# EAGLE design sim800c_gsm_dev_board (EAGLE 7.6.0)
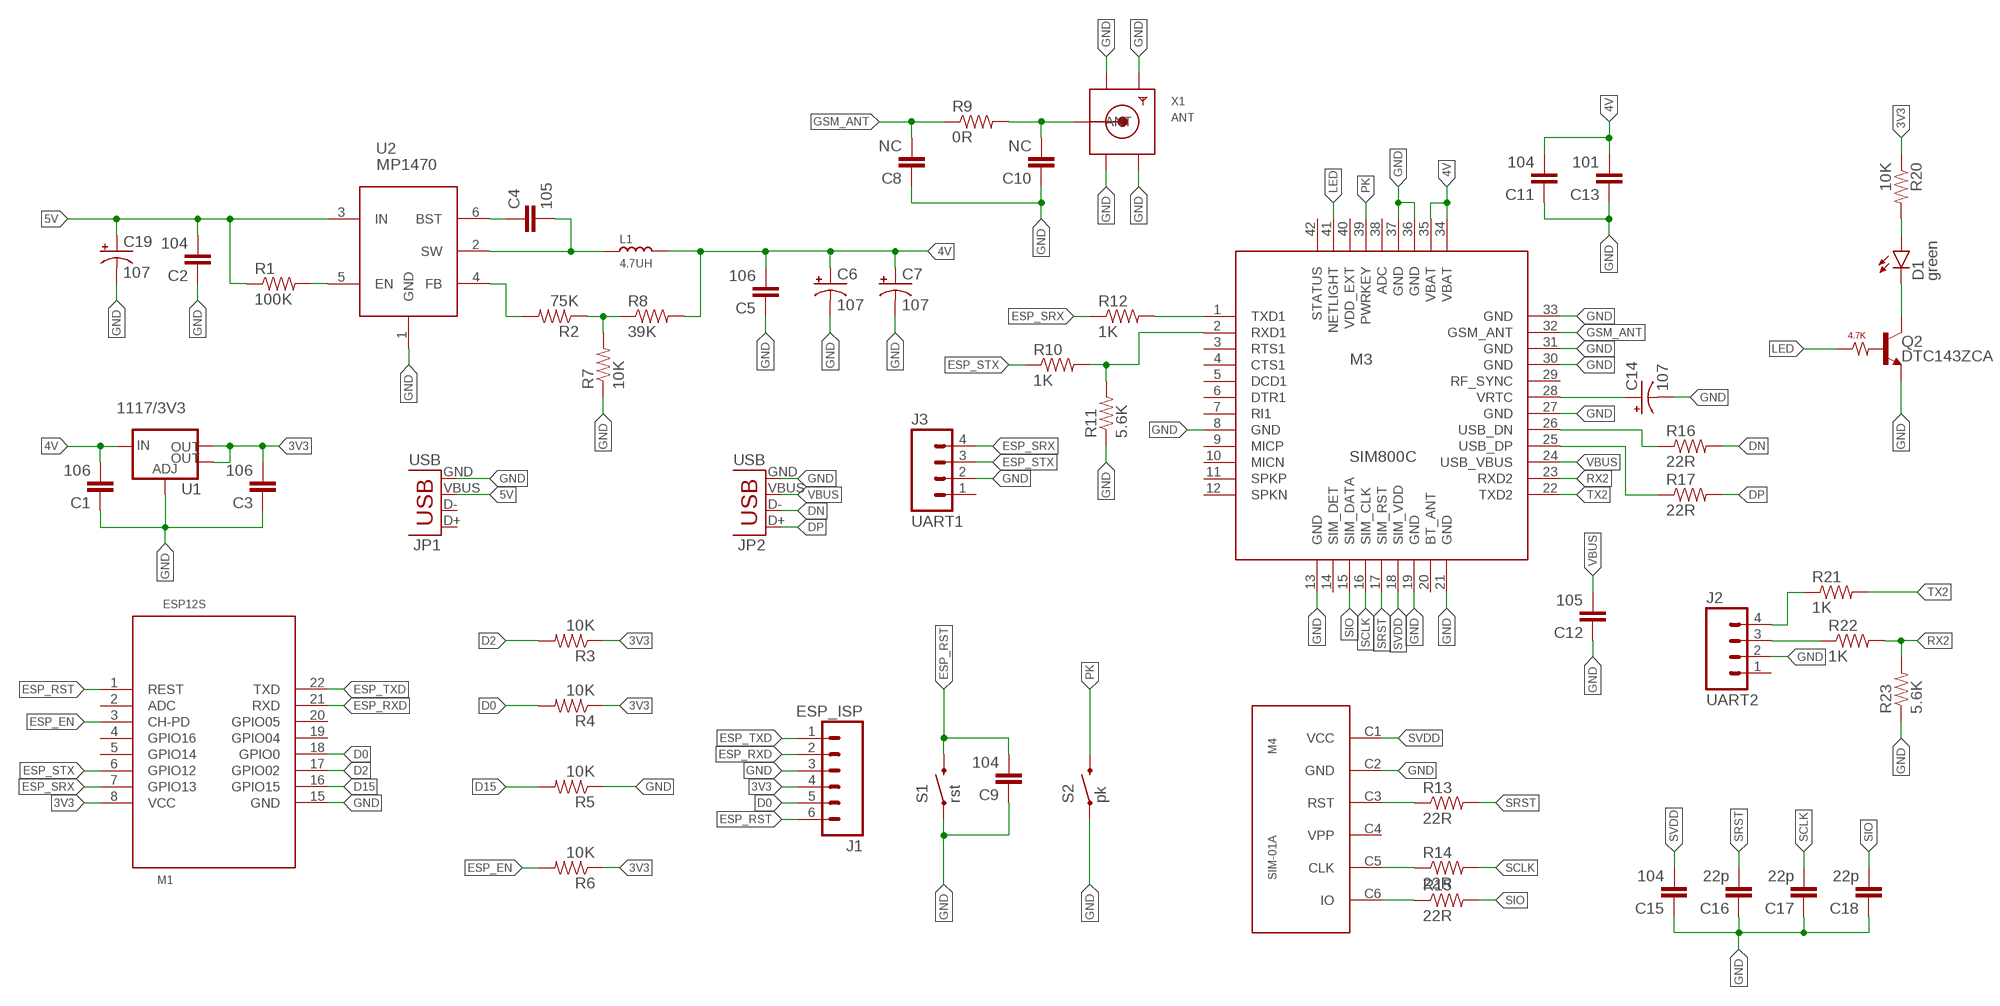
[diagram p0: schematic, sheet 1]

## Parts
C1  106  CAP0603-CAP  [0603-CAP]
C2  104  CAP0603-CAP  [0603-CAP]
C3  106  CAP0603-CAP  [0603-CAP]
C4  105  CAP0603-CAP  [0603-CAP]
C5  106  CAP0603-CAP  [0603-CAP]
C6  107  CAP_POL3528  [EIA3528]
C7  107  CAP_POL3528  [EIA3528]
C8  NC  CAP-SEEED-0402  [C0402]
C9  104  CAP-SEEED-0402  [C0402]
C10  NC  CAP-SEEED-0402  [C0402]
C11  104  CAP-SEEED-0402  [C0402]
C12  105  CAP0603-CAP  [0603-CAP]
C13  101  CAP-SEEED-0402  [C0402]
C14  107  CAP_POL3528  [EIA3528]
C15  104  CAP-SEEED-0402  [C0402]
C16  22p  CAP-SEEED-0402  [C0402]
C17  22p  CAP-SEEED-0402  [C0402]
C18  22p  CAP-SEEED-0402  [C0402]
C19  107  CAP_POL3528  [EIA3528]
D1  green  LED-SEEED-0603  [LED-0603-SEEED]
J1  ESP_ISP  M06NO_SILK_FEMALE_PTH  [1X06_NO_SILK]
J2  UART2  M04NO_SILK_ALL_ROUND  [1X04_NO_SILK_ALL_ROUND]
J3  UART1  M04NO_SILK_ALL_ROUND  [1X04_NO_SILK_ALL_ROUND]
JP1  USB  [MICROUSB-U-F-M5DD-Y-1]
JP2  USB  [MICROUSB-U-F-M5DD-Y-1]
L1  4.7UH  SMD-INDUCTOR-200UH-20%(2P-5X5MM)  [SMD-2P-5.0X5.0X2.0MM]
M1  ESP12S  MODULE-WIFI-ESP8266-12E-SIMPLE  [LGA22-2.0-24X16MM-SIMPLE]
M3  SIM800C  [SIM800C]
M4  SIM-01A  [SIM-01A]
Q2  DTC143ZCA  TRANS_NPN_RES-DDTD142TC-7-F  [SOT23-3]
R1  100K  RESISTOR-SEEED-0402  [R0402]
R2  75K  RESISTOR-SEEED-0402  [R0402]
R3  10K  RESISTOR-SEEED-0402  [R0402]
R4  10K  RESISTOR-SEEED-0402  [R0402]
R5  10K  RESISTOR-SEEED-0402  [R0402]
R6  10K  RESISTOR-SEEED-0402  [R0402]
R7  10K  RESISTOR-SEEED-0402  [R0402]
R8  39K  RESISTOR-SEEED-0402  [R0402]
R9  0R  RESISTOR-SEEED-0402  [R0402]
R10  1K  RESISTOR-SEEED-0402  [R0402]
R11  5.6K  RESISTOR-SEEED-0402  [R0402]
R12  1K  RESISTOR-SEEED-0402  [R0402]
R13  22R  RESISTOR-SEEED-0402  [R0402]
R14  22R  RESISTOR-SEEED-0402  [R0402]
R15  22R  RESISTOR-SEEED-0402  [R0402]
R16  22R  RESISTOR-SEEED-0402  [R0402]
R17  22R  RESISTOR-SEEED-0402  [R0402]
R20  10K  RESISTOR-SEEED-0402  [R0402]
R21  1K  RESISTOR-SEEED-0402  [R0402]
R22  1K  RESISTOR-SEEED-0402  [R0402]
R23  5.6K  RESISTOR-SEEED-0402  [R0402]
S1  rst  SWITCH-MOMENTARY-2SMD-4  [TACTILE_SWITCH_TALL]
S2  pk  SWITCH-MOMENTARY-2SMD-4  [TACTILE_SWITCH_TALL]
U1  1117/3V3  AMS1117SOT223  [SOT223]
U2  MP1470  [SOT23-6]
X1  ANT  SMACONNECTOR  [SMA90_DIP]

## Nets
3V3: C3.2 J1.4 M1.8(VCC) R3.1 R4.1 R6.1 R20.1 U1.2(OUT) U1.4(OUT)
4V: C1.2 C5.2 C6.A(+) C7.A(+) C11.2 C13.2 L1.2 M3.34(VBAT) M3.35(VBAT) R8.2 U1.3(IN)
5V: C2.2 C19.A(+) JP1.VBUS R1.1 U2.3(IN)
D0: J1.5 M1.18(GPIO0) R4.2
D2: M1.17(GPIO02) R3.2
D15: M1.16(GPIO15) R5.2
DN: JP2.D- R16.2
DP: JP2.D+ R17.2
ESP_EN: M1.3(CH-PD) R6.2
ESP_RST: C9.2 J1.6 M1.1(REST) S1.B2
ESP_RXD: J1.2 M1.21(RXD)
ESP_SRX: J3.4 M1.7(GPIO13) R12.1
ESP_STX: J3.3 M1.6(GPIO12) R10.1
ESP_TXD: J1.1 M1.22(TXD)
GND: C1.1 C2.1 C3.1 C5.1 C6.C(-) C7.C(-) C8.1 C9.1 C10.1 C11.1 C12.1 C13.1 C14.C(-) C15.1 C16.1 C17.1 C18.1 C19.C(-) J1.3 J2.2 J3.2 JP1.GND JP2.GND M1.15(GND) M3.8(GND) M3.13(GND) M3.19(GND) M3.21(GND) M3.27(GND) M3.30(GND) M3.31(GND) M3.33(GND) M3.36(GND) M3.37(GND) M4.C2(GND) Q2.2(E) R5.1 R7.1 R11.1 R23.1 S1.A2 S2.A2 U1.1(ADJ) U2.1(GND) X1.GND1 X1.GND2 X1.GND3 X1.GND4
GSM_ANT: C8.2 M3.32(GSM_ANT) R9.1
LED: M3.41(NETLIGHT) Q2.1(B)
N$1: J2.4 R21.1
N$2: R1.2 U2.5(EN)
N$4: M4.C3(RST) R13.1
N$6: C4.1 U2.6(BST)
N$7: M4.C5(CLK) R14.1
N$8: M4.C6(IO) R15.1
N$9: R2.2 U2.4(FB)
N$10: R2.1 R7.2 R8.1
N$11: C10.2 R9.2 X1.ANTENNA(ANT)
N$12: M3.1(TXD1) R12.2
N$13: M3.2(RXD1) R10.2 R11.2
N$14: D1.-(C) Q2.3(C)
N$15: D1.+(A) R20.2
N$16: J2.3 R22.1
N$24: M3.25(USB_DP) R17.1
N$25: M3.26(USB_DN) R16.1
N$27: C14.A(+) M3.28(VRTC)
PK: M3.39(PWRKEY) S2.B2
RX2: M3.23(RXD2) R22.2 R23.2
SCLK: C17.2 M3.16(SIM_CLK) R14.2
SIO: C18.2 M3.15(SIM_DATA) R15.2
SRST: C16.2 M3.17(SIM_RST) R13.2
SVDD: C15.2 M3.18(SIM_VDD) M4.C1(VCC)
SW: C4.2 L1.1 U2.2(SW)
TX2: M3.22(TXD2) R21.2
VBUS: C12.2 JP2.VBUS M3.24(USB_VBUS)
Unconnected: J2.1 J3.1 JP1.D+ JP1.D- M1.2(ADC) M1.4(GPIO16) M1.5(GPIO14) M1.19(GPIO04) M1.20(GPIO05) M3.3(RTS1) M3.4(CTS1) M3.5(DCD1) M3.6(DTR1) M3.7(RI1) M3.9(MICP) M3.10(MICN) M3.11(SPKP) M3.12(SPKN) M3.14(SIM_DET) M3.20(BT_ANT) M3.29(RF_SYNC) M3.38(ADC) M3.40(VDD_EXT) M3.42(STATUS) M4.C4(VPP)

## Library data of the parts
C1-C5 C8-C13 C15-C18 = z_jlc_smt:CAP: Capacitor Standard 0603 ceramic capacitor, and 0.1" leaded capacitor.
C6 C7 C14 C19 = z_jlc_smt:CAP_POL: Capacitor Polarized These are standard SMD and PTH capacitors. Normally 10uF, 47uF, and 100uF in electrolytic and tantalum varieties. Always verify the external diameter of the through hole cap, it varies with capacity, voltage, and manufacturer. The EIA devices should be standard.
D1 = z_jlc_smt:LED: LEDs Standard schematic elements and footprints for 5mm, 3mm, 1206, and 0603 sized LEDs. 5mm - Spark Fun Electronics SKU : COM-00529 (and others)
J1 = SparkFun-Connectors:M06: Header 6 Standard 6-pin 0.1" header. Use with straight break away headers (SKU : PRT-00116), right angle break away headers (PRT-00553), swiss pins (PRT-00743), machine pins (PRT-00117), and female headers (PRT-00115). Molex polarized connector foot print use with SKU : PRT-08094 with associated crimp pins and housings. NOTES ON THE VARIANTS LOCK and LOCK_LONGPADS... This footprint was designed to help hold the alignment of a through-hole component (i.e. 6-pin header) while soldering it into place. You may notice that each hole has been shifted either up or down by 0.005 of an inch from it's more standard position (which is a perfectly straight line). This slight alteration caused the pins (the squares in the middle) to touch the edges of the holes. Because they are alternating, it causes a "brace" to hold the component in place. 0.005 has proven to be the perfect amount of "off-center" position when using our standard breakaway headers. Although looks a little odd when you look at the bare footprint, once you have a header in there, the alteration is very hard to notice. Also,if you push a header all the way into place, it is covered up entirely on the bottom side. This idea of altering the position of holes to aid alignment will be further integrated into the Sparkfun Library for other footprints. It can help hold any component with 3 or more connection pins.; PROD_ID: CONN-08437
J2 J3 = SparkFun-Connectors:M04: Header 4 Standard 4-pin 0.1" header. Use with straight break away headers (SKU : PRT-00116), right angle break away headers (PRT-00553), swiss pins (PRT-00743), machine pins (PRT-00117), and female headers (PRT-00115). Molex polarized connector foot print use with SKU : PRT-08231 with associated crimp pins and housings. 1MM SMD Version SKU: PRT-10208; PROD_ID: CONN-09696
JP1 JP2 = xmgu2008:USB: USB Connectors USB-B-PTH is fully proven SKU : PRT-00139/CONN-08278 USB-miniB is fully proven SKU : PRT-00587 USB-A-PCB is untested. USB-A-H is throughly reviewed, but untested. Spark Fun Electronics SKU : PRT-00437 USB-B-SMT is throughly reviewed, but untested. Needs silkscreen touching up. USB-A-S has not been used/tested USB-MB-H has not been used/tested USB-MICROB has been used. CONN-09505
L1 = Seeed-OPL-Inductor:SMD-INDUCTOR-200UH-20%(2P-5X5MM): 303010140; MPN: SWPA5020S220MT; VALUE: 200UH
M1 = xmgu2008_modules:MODULE-WIFI-ESP8266-12E-SIMPLE
M3 = xmgu2008:SIM800C
M4 = xmgu2008:SIM-01A
Q2 = xmgu2008:TRANS_NPN_RES: NPN transistor with built in base resistor Current controlled device with built in current control for tighter layouts. Link to datasheet <http://www.diodes.com/_files/datasheets/ds30399.pdf>. SparkFun Products: SparkFun OpenSegment Serial Display - White <https://www.sparkfun.com/products/11644> SparkFun OpenSegment Serial Display - Red <https://www.sparkfun.com/products/11644>; PROD_ID: TRANS-11480; VALUE: 500mA/50V
R1-R17 R20-R23 = z_jlc_smt:RESISTOR: Resistor Basic schematic elements and footprints for 0603, 1206, and PTH resistors.
S1 S2 = xmgu2008:SWITCH-MOMENTARY-2: Various NO switches- pushbuttons, reed, etc; PROD_ID: SWCH-11966
U1 = xmgu2008:AMS1117: Voltage Regulator AMS1117; PROD_ID: VREG-08170
U2 = xmgu2008:MP1470
X1 = xmgu2008:SMACONNECTOR: SMA Connector 90° DIP SMA Connector, 50 Ohm (4UConnector: 07259)

## Board
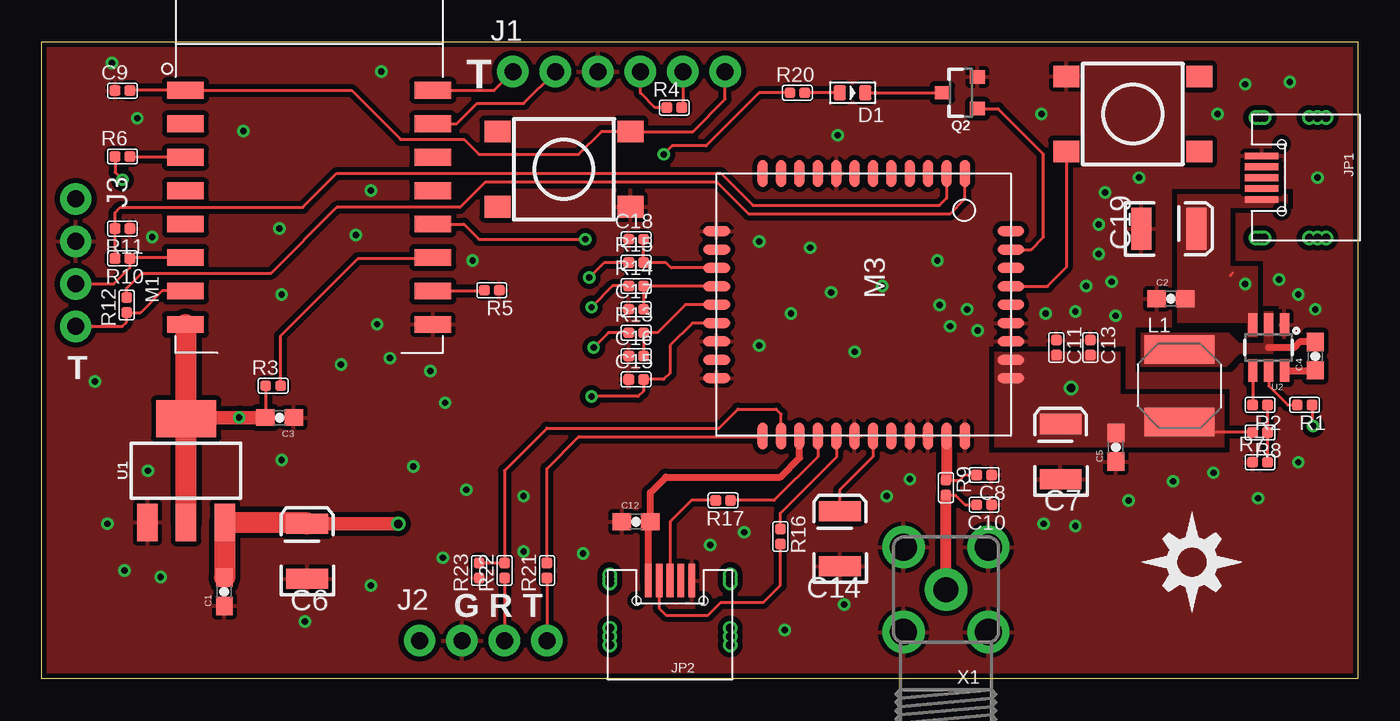
[diagram p1: board, top side]
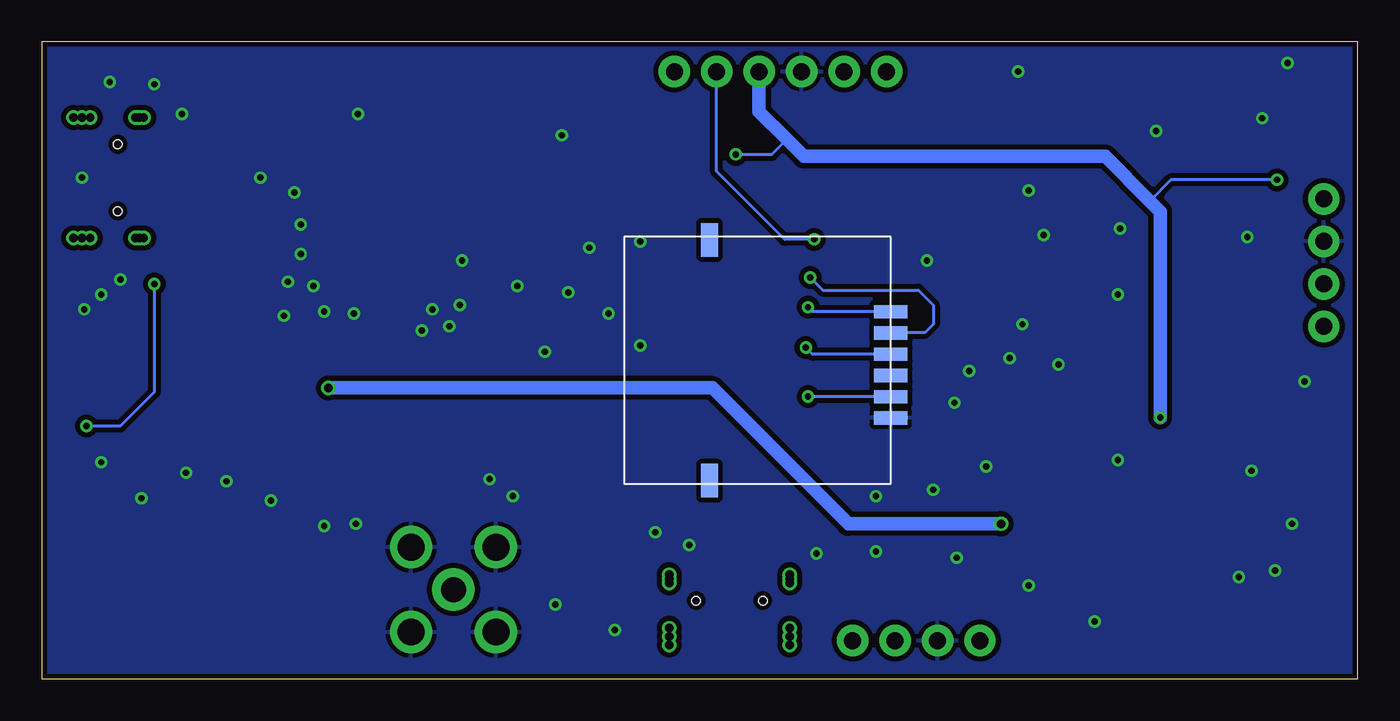
[diagram p2: board, bottom side, seen from below]

Size 78.74 x 38.1 mm. Coordinates in mm from the lower left corner, seen from the top.
Outline: 0,0 0,38.1 78.74,38.1 78.74,0 0,0
Copper layers (1*16): Top 0.035mm / dielectric 1.5mm / Bottom 0.035mm
Design rules "SparkFun-2-layer-TIGHT": minimum track width 7mil, minimum drill 15mil, track to track 7mil, track to pad 7mil, pad to pad 7mil, via to via 7mil, smd to smd 7mil, copper to edge 7mil, drill to drill 7mil, minimum pad ring 7mil, minimum via ring 7mil, stop-mask expansion 4mil, vias tented up to drill 20mil, thermal gap 10mil

### Footprints (pad centres in the part's own frame; a part is rotated, then mirrored left to right if it is on the bottom)
0603-CAP = smd 1.1 x 1: 1 -0.85,0; 2 0.85,0
EIA3528 = smd 1.2 x 2.5: A 1.65,0; C -1.65,0
C0402 = smd 0.635 x 0.635: 1 -0.445,0; 2 0.445,0
LED-0603-SEEED = smd 0.762 x 0.889: + 0.762,0; - -0.762,0
1X06_NO_SILK = drill 1.016 pad 1.88: 1 0,0; 2 2.54,0; 3 5.08,0; 4 7.62,0; 5 10.16,0; 6 12.7,0
1X04_NO_SILK_ALL_ROUND = drill 1.016 pad 1.88: 1 0,0; 2 2.54,0; 3 5.08,0; 4 7.62,0
MICROUSB-U-F-M5DD-Y-1 = drill 0.5: 6_1 3.6,0.25; 6_2 3.6,0.5; 6_3 3.6,0.75; 7_1 3.6,3.45; 7_2 3.6,3.95; 7_3 3.6,4.45; 8_1 -3.6,4.45; 8_2 -3.6,3.95; 8_3 -3.6,3.45; 9_1 -3.6,0.75; 9_2 -3.6,0.5; 9_3 -3.6,0.25 | smd 0.4 x 2: D+ 0,0.6; D- 0.65,0.6; GND -1.3,0.6; ID -0.65,0.6; VBUS 1.3,0.6 | hole 0.5: -2,1.8; 2,1.8
SMD-2P-5.0X5.0X2.0MM = smd 4.2 x 1.7: 1 0,2.175; 2 0,-2.175
LGA22-2.0-24X16MM-SIMPLE = smd 2.2 x 1: 1 -7.4,3.7; 2 -7.4,1.7; 3 -7.4,-0.3; 4 -7.4,-2.3; 5 -7.4,-4.3; 6 -7.4,-6.3; 7 -7.4,-8.3; 8 -7.4,-10.3; 15 7.4,-10.3; 16 7.4,-8.3; 17 7.4,-6.3; 18 7.4,-4.3; 19 7.4,-2.3; 20 7.4,-0.3; 21 7.4,1.7; 22 7.4,3.7
SIM800C = smd 1.6 x 0.6: 1 0,14.85; 2 0,13.75; 3 0,12.65; 4 0,11.55; 5 0,10.45; 6 0,9.35; 7 0,8.25; 8 0,7.15; 9 0,6.05; 10 0,4.95; 11 0,3.85; 12 0,2.75; 22 15.7,2.75; 23 15.7,3.85; 24 15.7,4.95; 25 15.7,6.05; 26 15.7,7.15; 27 15.7,8.25; 28 15.7,9.35; 29 15.7,10.45; 30 15.7,11.55; 31 15.7,12.65; 32 15.7,13.75; 33 15.7,14.85 | smd 0.6 x 1.6: 13 3.45,0; 14 4.55,0; 15 5.65,0; 16 6.75,0; 17 7.85,0; 18 8.95,0; 19 10.05,0; 20 11.15,0; 21 12.25,0; 34 12.25,17.6; 35 11.15,17.6; 36 10.05,17.6; 37 8.95,17.6; 38 7.85,17.6; 39 6.75,17.6; 40 5.65,17.6; 41 4.55,17.6; 42 3.45,17.6
SIM-01A = smd 0.8 x 2: C1 -2.18,0; C2 -3.45,0; C3 0.36,0; C4 -0.91,0; C5 2.9,0; C6 1.63,0 | smd 2 x 1: NC@10 -7.2,10.85; NC@11 7.2,10.85
SOT23-3 = smd 0.8 x 0.9: 1 -0.95,-1; 2 0.95,-1; 3 0,1.1
R0402 = smd 0.635 x 0.635: 1 -0.445,0; 2 0.445,0
TACTILE_SWITCH_TALL = smd 1.55 x 1.3: A1 -3.975,-2.25; A2 3.975,-2.25; B1 -3.975,2.25; B2 3.975,2.25
SOT223 = smd 1.219 x 2.235: 1 -2.311,-3.099; 2 0,-3.099; 3 2.311,-3.099 | smd 3.6 x 2.2: 4 0,3.099
SOT23-6 = smd 0.55 x 1.35: 1 -0.95,-1.375; 2 0,-1.375; 3 0.95,-1.375; 4 0.95,1.375; 5 0,1.375; 6 -0.95,1.375
SMA90_DIP = drill 1.5 pad 2.54: ANTENNA 0,0 | drill 1.6 pad 2.54: GND1 -2.54,2.54; GND2 2.54,2.54; GND3 -2.54,-2.54; GND4 2.54,-2.54

### Placement (x,y rotation side)
C1  10.92,5.21 90 top
C2  67.56,22.73 0 top
C3  14.22,15.62 180 top
C4  76.2,19.3 90 top
C5  64.26,13.84 90 top
C6  15.88,7.62 90 top
C7  60.96,13.59 90 top
C8  56.39,12.19 180 top
C9  4.83,35.18 0 top
C10  56.39,10.41 180 top
C11  60.71,19.81 270 top
C12  35.56,9.4 0 top
C13  62.74,19.81 270 top
C14  47.75,8.38 90 top
C15  35.56,17.91 0 top
C16  35.56,19.3 0 top
C17  35.56,22.1 0 top
C18  35.56,26.29 0 top
C19  67.44,26.92 0 top
D1  48.51,35.05 180 top
J1  28.19,36.32 0 top
J2  22.61,2.29 0 top
J3  2.03,28.7 270 top
JP1  72.39,29.97 270 top
JP2  37.59,6.48 180 top
L1  68.07,17.53 0 top
M1  16,31.5 0 top
M3  40.39,30.23 270 top
M4  27.94,19.05 90 bottom
Q2  54.99,35.05 90 top
R1  75.56,16.38 180 top
R2  72.9,16.38 180 top
R3  13.84,17.53 0 top
R4  37.85,34.16 0 top
R5  26.92,23.24 180 top
R6  4.83,31.24 0 top
R7  72.9,12.95 0 top
R8  72.9,14.73 180 top
R9  54.1,11.43 270 top
R10  4.83,25.15 180 top
R11  4.83,26.92 180 top
R12  5.08,22.35 90 top
R13  35.56,20.7 0 top
R14  35.56,23.5 0 top
R15  35.56,24.89 0 top
R16  44.2,8.51 270 top
R17  40.77,10.67 180 top
R20  45.21,35.05 0 top
R21  30.23,6.48 90 top
R22  27.69,6.48 90 top
R23  26.16,6.48 90 top
S1  31.24,30.48 0 top
S2  65.28,33.78 180 top
U1  8.64,12.45 0 top
U2  73.41,19.81 180 top
U$1  [DIYNOVA_LOGO]  65.79,3.94 0 top
X1  54.1,5.33 180 top

### Tracks (layer width: path | path; a pad name or v marks a point on that pad's centre or on a via)
3V3  (via drill 0.38)
  Top 0.178: R3.1 13.4,15.65 C3.2 | R4.1 36.7,34.16 35.81,35.05 J1.4 | R20.1 42.93,35.05 39.75,31.88 37.72,31.88 v37.21,31.37 | R6.1 4.38,30.29 v4.83,29.84
  Top 0.813: 8.71,15.62 v11.81,15.62 C3.2
  Top 1.27: U1.4 8.64,21.16 M1.8 | U1.2 U1.4 | 8.71,15.62 U1.4
  Bottom 0.178: v37.21,31.37 35.05,31.37 34.16,32.26 | v4.83,29.84 11.18,29.84 12.45,28.57
  Bottom 0.813: J1.4 35.81,33.91 34.16,32.26 33.15,31.24 15.11,31.24 12.45,28.57 11.81,27.94 v11.81,15.62
4V  (via drill 0.51)
  Top 0.178: R8.2 70.23,14.73
  Top 0.813: C6.A v21.34,9.27
  Top 1.27: C1.2 10.95,6.08 U1.3 15.8,9.35 C6.A
  Bottom 0.813: v21.34,9.27 30.48,9.27 38.61,17.4 v61.59,17.4
  pour Top (isolate 0.305, no thermals): 57.02,19.56 64.52,19.56 64.52,17.02 70.74,17.02 70.74,13.84 57.02,13.84
5V  (via drill 0.38)
  Top 0.178: 71.25,24.26 71.12,24.13 | R1.1 76.01,15.18 v76.07,15.11
  Bottom 0.178: v72.01,23.62 72.01,17.14 74.04,15.11 v76.07,15.11
  pour Top (isolate 0.305, no thermals): 74.55,28.96 67.94,28.96 67.94,21.34 72.14,21.34 72.14,20.45 72.77,20.45 72.77,24.64 71.12,24.64 71.12,28.19 74.55,28.19
D0  (via drill 0.38)
  Top 0.178: J1.5 38.35,34.23 R4.2 | M1.18 25.25,27.2 26.16,26.29 v32.51,26.29
  Bottom 0.178: v32.51,26.29 34.29,26.29 38.35,30.35 J1.5
D2
  Top 0.178: R3.2 14.29,20.51 18.92,25.15 23.35,25.15 M1.17
D15
  Top 0.178: M1.16 26.43,23.2 R5.2
DN
  Top 0.178: R16.2 44.2,5.59 43.18,4.57 40.64,4.57 39.88,3.81 37.34,3.81 36.94,4.21 JP2.D-
DP
  Top 0.178: R17.2 38.86,10.67 37.59,9.4 JP2.D+
ESP_EN
  Top 0.178: M1.3 5.32,31.2 R6.2
ESP_RST
  Top 0.178: C9.2 5.29,35.2 M1.1 18.52,35.2 21.46,32.26 25.27,32.26 26.16,31.37 32.13,31.37 33.49,32.73 S1.B2 38.95,32.73 40.89,34.67 J1.6
ESP_RXD
  Top 0.178: M1.21 24.81,33.2 26.04,34.42 28.83,34.42 J1.2
ESP_SRX
  Top 0.178: J3.4 4.83,21.08 5.08,21.34 R12.1 5.91,21.91 7.19,23.2 M1.7
ESP_STX
  Top 0.178: M1.6 5.32,25.2 R10.1 5.27,24.57 4.32,23.62 J3.3
ESP_TXD
  Top 0.178: M1.22 27.07,35.2 J1.1
GND  (via drill 0.38)
  other vias: 40.01,8 44.45,2.92 32.38,7.49 24,7.24 22.23,12.7 51.94,11.94 65.02,10.67 67.69,11.81 61.85,9.14 75.18,12.95 75.18,22.99 65.66,29.97 63.25,27.18 64.01,23.75 61.85,21.97 74.68,35.69 76.33,29.97 59.82,33.78 14.35,13.08 5.71,33.53 6.6,26.42 14.22,26.92 19.68,29.21 12.06,32.77 20.32,36.32 25.4,11.3 60.07,21.84 56.01,20.83 55.37,22.1 54.36,21.08 53.72,22.35 64.26,21.72 62.48,23.5 63.25,25.4 63.63,29.08 70.36,33.78 72.01,35.56 76.2,22.1 74.04,23.88 59.94,9.27 70.1,12.32 72.77,10.79 19.68,5.59 15.75,3.43 7.11,6.1 4.95,6.48 3.94,9.27 6.35,12.45 20.07,21.21 20.83,19.18 23.24,18.41 24.13,16.51 25.78,25.02 18.8,26.54 42.93,26.16 47.62,32.51 48.01,4.45 50.55,10.92 42.93,19.94 48.64,19.56 4.19,36.83 3.17,17.78 14.35,22.99 17.91,18.8 50.29,23.5 47.24,23.11 44.83,21.84 45.97,25.78 53.59,25.02 42.04,8.76 28.83,7.62 28.83,10.92
  pour Bottom (isolate 0.305): 0,0 0,38.1 78.74,38.1 78.74,0
  pour Top (isolate 0.305, rank 3): 0,0 0,38.1 78.74,38.1 78.74,0
GSM_ANT
  Top 0.178: R9.1 54.93,11.87 55.24,12.19 C8.2
  Top 0.66: M3.32 54.14,11.91 R9.1
LED
  Top 0.178: M3.41 59.2,25.68 59.94,26.42 59.94,31.37 57.21,34.1 Q2.1
N$1
  Top 0.178: R21.1 J2.4
N$2
  Top 0.178: U2.5 73.41,17.53 74.55,16.38 R1.2
N$4  (via drill 0.38)
  Top 0.178: R13.1 33.91,20.7 v33.02,19.81
  Bottom 0.178: M4.C3 32.62,19.41 v33.02,19.81
N$6
  Top 0.406: U2.6 76.18,18.44 C4.1
N$7  (via drill 0.38)
  Top 0.178: R14.1 34.16,23.5 v32.89,22.23
  Bottom 0.178: v32.89,22.23 32.64,21.97 27.96,21.97 M4.C5
N$8  (via drill 0.38)
  Top 0.178: R15.1 33.66,24.89 v32.77,24
  Bottom 0.178: v32.77,24 32,23.24 26.29,23.24 25.4,22.35 25.4,21.21 25.91,20.7 27.92,20.7 M4.C6
N$9
  Top 0.178: U2.4 R2.2
N$10
  Top 0.178: R2.1 R8.1 R7.2
N$11
  Top 0.178: R9.2 54.67,10.99 55.24,10.41 C10.2
  Top 0.66: X1.ANTENNA R9.2
N$12
  Top 0.178: M3.1 55.24,30.22 55.24,28.7 54.36,27.81 42.29,27.81 40.39,29.72 26.54,29.72 25.02,28.19 17.65,28.19 13.72,24.26 5.97,24.26 5.08,23.37 R12.2
N$13
  Top 0.178: R10.2 R11.2 4.38,27.88 4.7,28.19 15.62,28.19 17.65,30.23 40.64,30.23 42.55,28.32 53.72,28.32 54.14,28.74 M3.2
N$14
  Top 0.178: D1.- Q2.3
N$15
  Top 0.178: D1.+ R20.2
N$16
  Top 0.178: R22.1 J2.3
N$24
  Top 0.178: M3.25 46.44,13.29 43.81,10.67 R17.1
N$25
  Top 0.178: R16.1 44.2,9.91 47.54,13.25 M3.26
N$27
  Top 0.178: C14.A 47.75,11.3 49.74,13.29 M3.28
PK
  Top 0.178: M3.39 60.18,23.48 61.3,24.6 S2.B2
RX2
  Top 0.178: R23.2 R22.2 27.69,12.45 30.23,14.99 40.51,14.99 41.66,16.13 43.94,16.13 44.24,15.84 M3.23
SCLK
  Top 0.178: M3.16 36.02,23.48 R14.2 C17.2
SIO
  Top 0.178: M3.15 37.65,24.58 37.34,24.89 R15.2 C18.2
SRST
  Top 0.178: M3.17 38.51,22.38 36.83,20.7 R13.2 C16.2
SVDD  (via drill 0.38)
  Top 0.178: M3.18 38.93,21.28 37.59,19.94 37.59,18.29 37.21,17.91 C15.2 36.01,17.21 35.69,16.89 v32.89,16.89
  Bottom 0.178: v32.89,16.89 27.96,16.89 M4.C1
SW
  Top 0.406: C4.2 75.27,20.15 74.93,19.81 73.41,19.81
  pour Top (isolate 0.305, no thermals): 65.79,20.7 70.99,20.7 71.63,20.07 73.15,20.07 73.15,21.97 73.66,21.97 73.66,19.43 71.63,19.43 70.87,18.67 65.79,18.67
TX2
  Top 0.178: R21.2 30.23,12.57 32.13,14.48 43.09,14.48 M3.22
VBUS
  Top 0.406: JP2.VBUS 36.29,9.28 C12.2 36.41,11.14 37.34,12.06 44.2,12.06 45.34,13.21 M3.24

### Text on the board
tPlace: T | T | G R T